# Altium project Gluon.PrjPCB
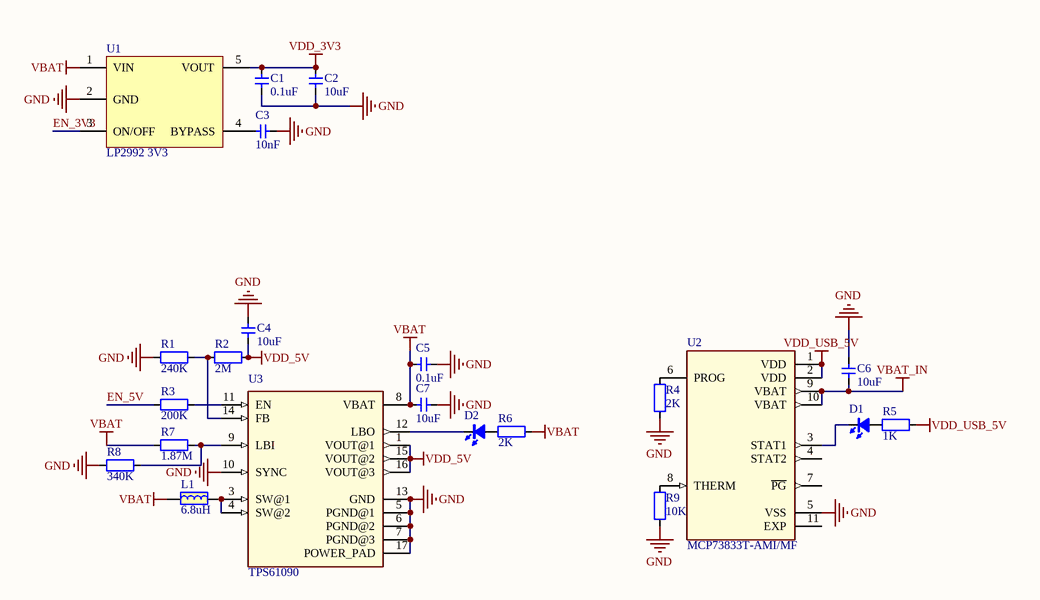
[diagram p0: Gluon.SchDoc]
1 sheet, 22 parts. Net scope: global (net labels, ports and power ports of the same name join across sheets).
Board file: Gluon.PcbDoc

## Sheet Gluon.SchDoc
size A4

### Parts
C1  0.1uF  [CAP_0402]
C2  10uF  [0603-CAP]
C3  10nF  [CAP_0402]
C4  10uF  [0603-CAP]
C5  0.1uF  [CAP_0402]
C6  10uF  [0603-CAP]
C7  10uF  [0603-CAP]
D1  color?  [LED_0402_RED]  (value not drawn)
D2  (no value)  [LED_0402_RED]
L1  6.8uH  [2520-L]
R1  240K  [RES_0402]
R2  2M  [RES_0402]
R3  200K  [RES_0402]
R4  2K  [RES_0402]
R5  1K  [RES_0402]
R6  2K  [RES_0402]
R7  1.87M  [RES_0402]
R8  340K  [RES_0402]
R9  10K  [RES_0402]
U1  LP2992 3V3  [SOT23-5]
U2  MCP73833T-AMI/MF  [QFN-10]
U3  TPS61090  [QFN-16]

### Nets
GND: C1.1 C2.1 C3.1 C4.2 C5.2 C6.2 C7.1 R1.1 R4.1 R8.1 R9.1 U1.2(GND) U2.5(VSS) U3.5(PGND@1) U3.6(PGND@2) U3.7(PGND@3) U3.10(SYNC) U3.13(GND) U3.17(POWER_PAD)
VBAT: C5.1 C7.2 L1.1 R6.2 R7.1 U1.1(VIN) U3.8(VBAT)
VBAT_IN: C6.1 U2.9(VBAT) U2.10(VBAT)
VDD_3V3: C1.2 C2.2 U1.5(VOUT)
VDD_5V: C4.1 R2.2 U3.1(VOUT@1) U3.15(VOUT@2) U3.16(VOUT@3)
VDD_USB_5V: R5.1 U2.1(VDD) U2.2(VDD)
EN_3V3: U1.3(ON/OFF)
EN_5V: R3.1
NetC3_2: C3.2 U1.4(BYPASS)
NetD1_1: D1.1(A) R5.2
NetD1_2: D1.2(K) U2.3(STAT1)
NetD2_1: D2.1(A) R6.1
NetD2_2: D2.2(K) U3.12(LBO)
NetL1_2: L1.2 U3.3(SW@1) U3.4(SW@2)
NetR1_2: R1.2 R2.1 U3.14(FB)
NetR3_2: R3.2 U3.11(EN)
NetR4_2: R4.2 U2.6(PROG)
NetR7_2: R7.2 R8.2 U3.9(LBI)
NetR9_2: R9.2 U2.8(THERM)

Not connected (* = marked no-connect by the designer): U2 4(STAT2) 7(~{PG}) 11(EXP)

### Library data of the parts
C1 C3 C5 = 电容-0402: Capacitor; Value: 0.1u
C2 C4 C6 C7 = 电容-0603: Capacitor; Value: 0.1u
D1 D2 = LED_0402: LED; Type: 0402
  D1: Value: color?
L1 = 电感-2520: 磁珠
R1-R9 = 电阻-0402: Resistor; Value: 22R
U1 = LP2992: LDO
U2 = MCP73833T: Linear Charge Management Controller Li-Ion/Li-Pol 1mA 4.2V/4.35V/4.4V/4.5V 10-Pin DFN EP T/R; MF: Microchip; Availability: Unavailable; Package: DFN-10 Microchip; Price: None; SnapEDA_Link: https://www.snapeda.com/parts/MCP73833T-AMI/MF/Microchip/view-part/?ref=snap; MP: MCP73833T-AMI/MF; Value: *
U3 = TPS61090: the tps6109x devices provide a power supply solution for products powered by either a one-cell li-ion or li-polymer o...; MF: Texas Instruments; Package: QFN-16 Texas Instruments; MP: TPS61090; Availability: Unavailable; Price: None; SnapEDA_Link: https://www.snapeda.com/parts/TPS61090/Texas%20Instruments/view-part/?ref=snap; Value: *